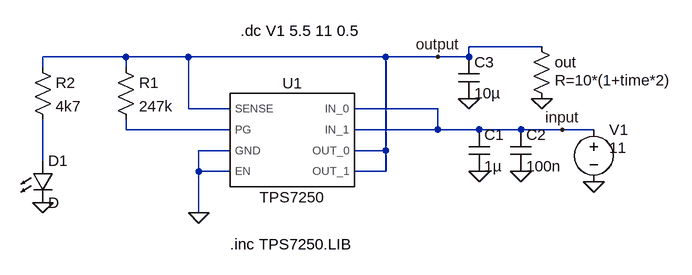
[diagram p0: schematic 11_1_1.asc]
11_1_1.asc, the LTspice schematic file:
Version 4
SHEET 1 1092 680
WIRE 208 128 96 128
WIRE -432 144 -560 144
WIRE -336 144 -432 144
WIRE -32 144 -336 144
WIRE 48 144 -32 144
WIRE 96 144 96 128
WIRE 96 144 48 144
WIRE -560 160 -560 144
WIRE -432 160 -432 144
WIRE -336 224 -336 144
WIRE -272 224 -336 224
WIRE 48 224 -80 224
WIRE -432 256 -432 240
WIRE -272 256 -432 256
WIRE 48 256 48 224
WIRE 48 256 -80 256
WIRE 112 256 48 256
WIRE 176 256 112 256
WIRE 240 256 176 256
WIRE 288 256 240 256
WIRE -272 288 -320 288
WIRE -32 288 -32 144
WIRE -32 288 -80 288
WIRE -560 304 -560 240
WIRE -320 320 -320 288
WIRE -272 320 -320 320
WIRE -32 320 -32 288
WIRE -32 320 -80 320
WIRE -320 384 -320 320
FLAG -560 368 0
FLAG -320 384 0
FLAG 112 320 0
FLAG 176 320 0
FLAG 96 208 0
FLAG 288 336 0
FLAG 240 256 input
FLAG 48 144 output
FLAG 208 208 0
SYMBOL AutoGenerated\\TPS7250 -176 272 R0
SYMATTR InstName U1
SYMBOL res -448 144 R0
SYMATTR InstName R1
SYMATTR Value 247k
SYMBOL res -576 144 R0
SYMATTR InstName R2
SYMATTR Value 4k7
SYMBOL LED -576 304 R0
SYMATTR InstName D1
SYMBOL cap 96 256 R0
SYMATTR InstName C1
SYMATTR Value 1µ
SYMBOL cap 160 256 R0
SYMATTR InstName C2
SYMATTR Value 100n
SYMBOL cap 80 144 R0
SYMATTR InstName C3
SYMATTR Value 10µ
SYMBOL voltage 288 240 R0
WINDOW 123 0 0 Left 0
WINDOW 39 0 0 Left 0
WINDOW 3 24 44 Left 2
SYMATTR Value 11
SYMATTR InstName V1
SYMBOL res 192 112 R0
WINDOW 3 36 68 Left 2
SYMATTR Value R=10*(1+time*2)
SYMATTR InstName out
TEXT -272 432 Left 2 !.inc TPS7250.LIB
TEXT -256 104 Left 2 !.dc V1 5.5 11 0.5

The netlist it stands for:
* 11_1_1.asc
XU1 output N001 0 0 input input output output TPS7250  ; pins SENSE PG GND EN IN_0 IN_1 OUT_0 OUT_1
R1 output N001 247k
R2 output N002 4k7
D1 N002 0 D
C1 input 0 1µ
C2 input 0 100n
C3 output 0 10µ
V1 input 0 11
R§out output 0 R=10*(1+time*2)
.model D D
.lib standard.dio
.inc TPS7250.LIB
.dc V1 5.5 11 0.5
.lib C:\Users\Jan Frost\Desktop\ANS\ASLK_PRO\docs\spice\Experiment_11\TPS7250.LIB
.backanno
.end